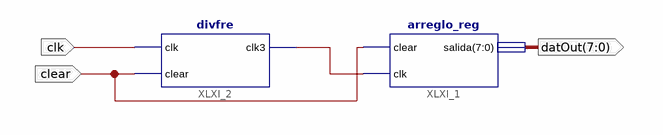
[diagram p0: schematic sheet 1]
// Xilinx ISE schematic SuperiorRegistro2.sch (spartan6) as structural Verilog: 2 symbols, 3 ports
module SuperiorRegistro2 (
  input  clk,
  input  clear,
  output [7:0] datOut
);

  wire XLXN_1;

  arreglo_reg XLXI_1 (.clear(clear), .clk(XLXN_1), .salida(datOut));
  divfre XLXI_2 (.clk(clk), .clear(clear), .clk3(XLXN_1));
endmodule
